# Altium schematic sheet DRV8873S_Breakout.SchDoc
size A4
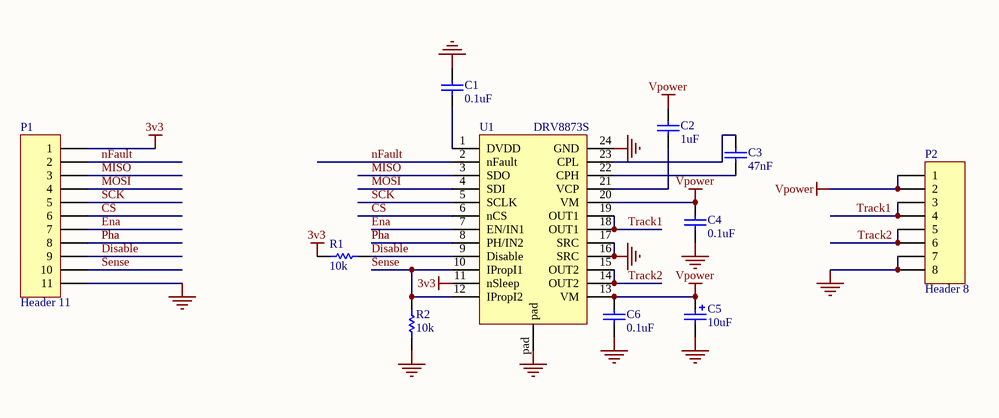
[diagram p0: DRV8873S_Breakout.SchDoc]

## Parts
C1  value 0.1uF  [Cap SMD 0805A]  (hidden comment: Cap)
C2  value 1uF  [Cap SMD 0805A]  (hidden comment: Cap)
C3  value 47nF  [Cap SMD 0805A]  (hidden comment: Cap)
C4  value 0.1uF  [Cap SMD 0805A]  (hidden comment: Cap)
C5  value 10uF  [Cap SMD Elect 5x5.3]  (hidden comment: Cap Pol)
C6  value 0.1uF  [Cap SMD 0805A]  (hidden comment: Cap)
P1  Header 11  [HDR1X11]
P2  Header 8  [HDR1X8]
R1  value 10k  [Res SMD 0805A]  (hidden comment: Res1)
R2  value 10k  [Res SMD 0805A]  (hidden comment: Res1)
U1  DRV8873S  [TSSOP24 PowerPAD]

## Nets
3v3: P1.1 R1.2 U1.11(nSleep)
GND: C1.1 C4.1 C5.2 C6.1 P1.11 P2.7 P2.8 R2.1 U1.16(SRC) U1.17(SRC) U1.24(GND) U1.pad
Vpower: C2.2 C4.2 C5.1 C6.2 P2.1 P2.2 U1.13(VM) U1.20(VM)
CS: P1.6 U1.6(nCS)
Disable: P1.9 R1.1 U1.9(Disable)
Ena: P1.7 U1.7(EN/IN1)
MISO: P1.3 U1.3(SDO)
MOSI: P1.4 U1.4(SDI)
nFault: P1.2 U1.2(nFault)
Pha: P1.8 U1.8(PH/IN2)
SCK: P1.5 U1.5(SCLK)
Sense: P1.10 R2.2 U1.10(IPropI1) U1.12(IPropI2)
Track1: P2.3 P2.4 U1.18(OUT1) U1.19(OUT1)
Track2: P2.5 P2.6 U1.14(OUT2) U1.15(OUT2)
NetC1_2: C1.2 U1.1(DVDD)
NetC2_1: C2.1 U1.21(VCP)
NetC3_1: C3.1 U1.22(CPH)
NetC3_2: C3.2 U1.23(CPL)

## Library data of the parts
C1-C4 C6 = Cap: Capacitor; Published: 8-Jun-2000; LatestRevisionDate: 17-Jul-2002; LatestRevisionNote: Re-released for DXP Platform.; PackageReference: RAD-0.3; Publisher: Altium Limited; PackageDescription: Radial Cap, Thru-Hole; 2 Leads; 0.3 in Pin Spacing
C5 = Cap Pol: Polarized Capacitor (Radial); Published: 8-Jun-2000; LatestRevisionDate: 17-Jul-2002; LatestRevisionNote: Re-released for DXP Platform.; PackageReference: RB7.6-15; Publisher: Altium Limited; PackageDescription: Polarized Capacitor (Radial); 2 Leads
P1 = Header 11: Header, 11-Pin; LatestRevisionDate: 17-Jul-2002; LatestRevisionNote: Re-released for DXP Platform.; Publisher: Altium Limited
P2 = Header 8: Header, 8-Pin; LatestRevisionDate: 17-Jul-2002; LatestRevisionNote: Re-released for DXP Platform.; Publisher: Altium Limited
R1 R2 = Resistor